# EAGLE schematic trackduino micro (EAGLE 7.1.0)
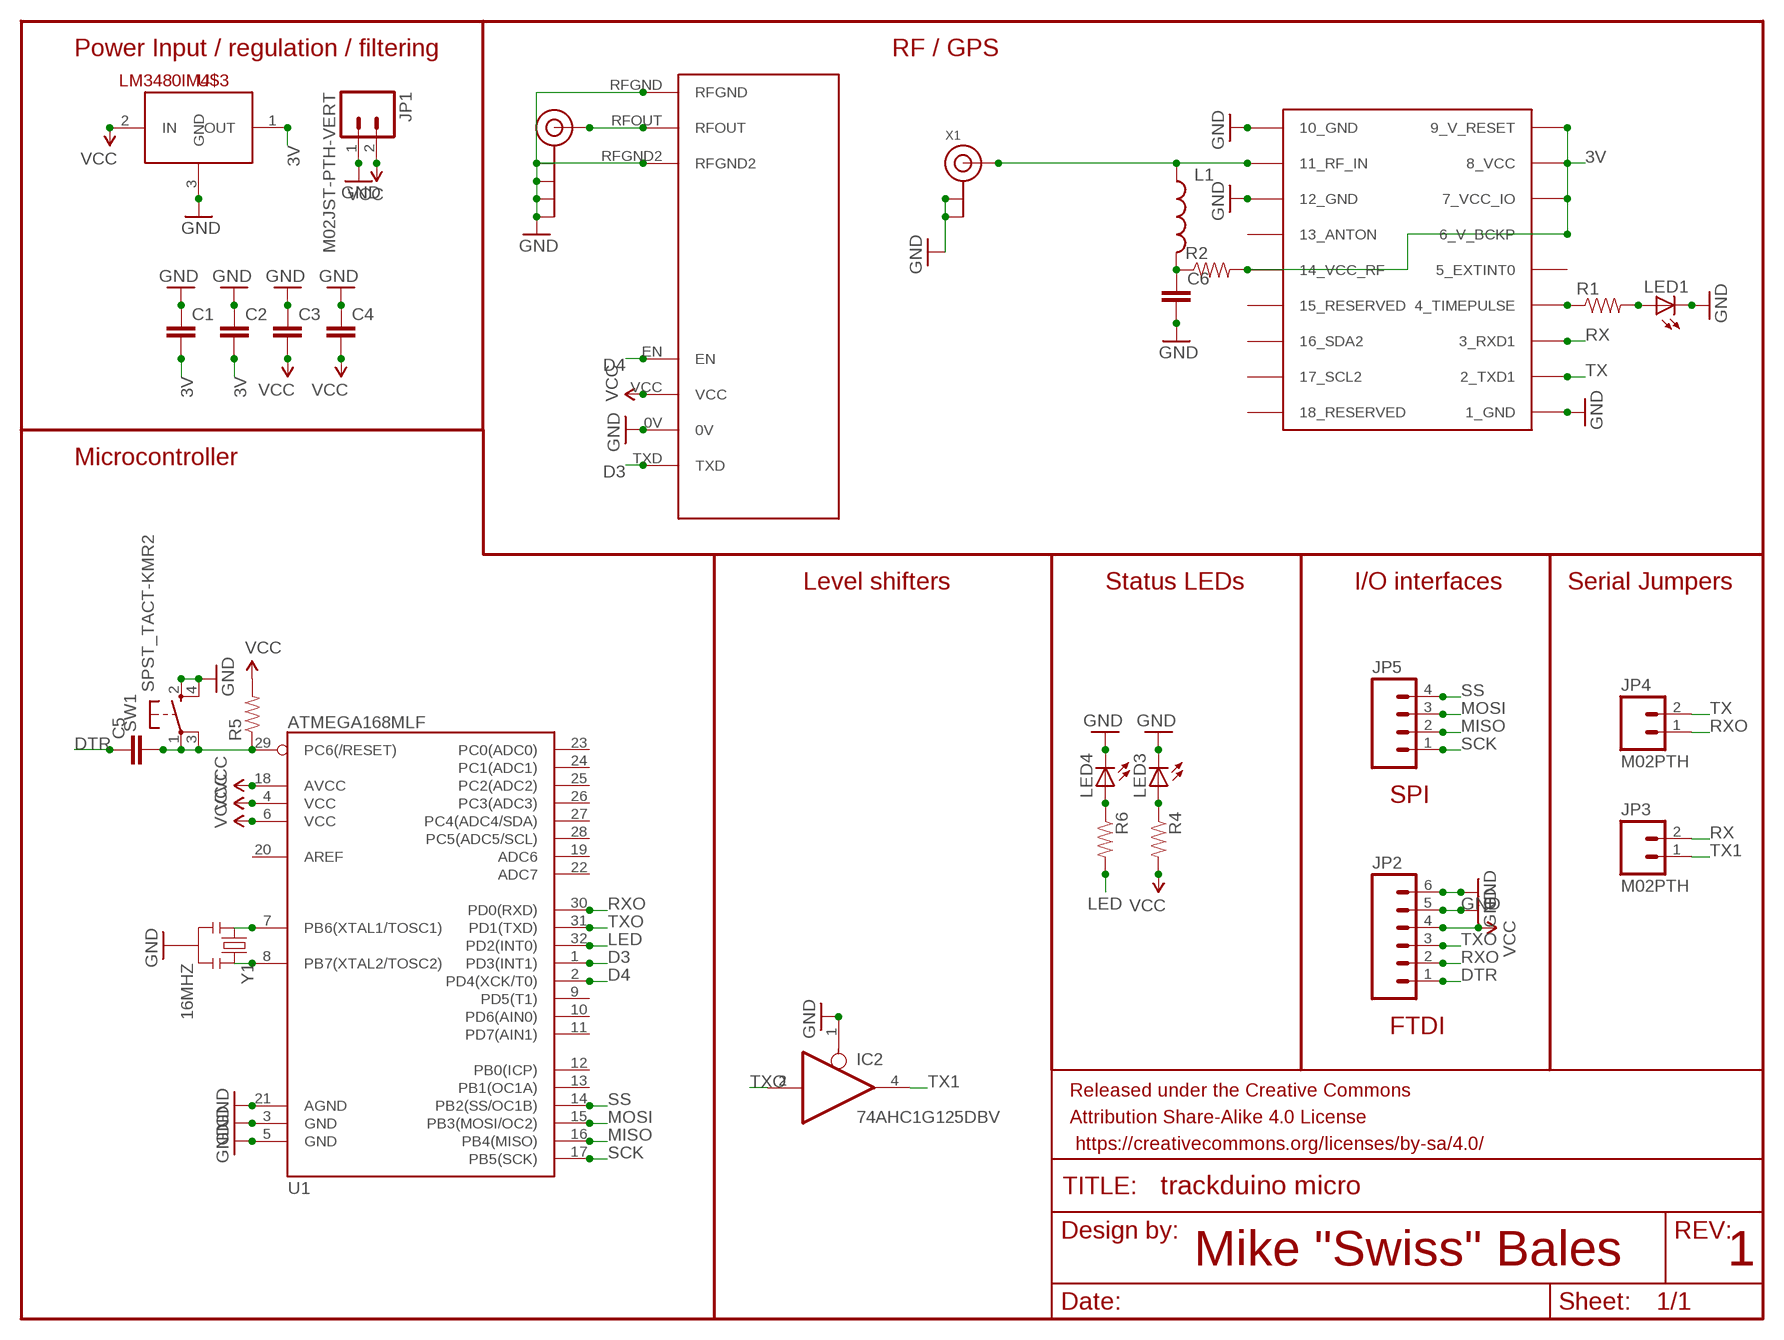
[diagram p0: schematic, sheet 1]

## Parts
C1  CAP0805  [0805]
C2  CAP0805  [0805]
C3  CAP0805  [0805]
C4  CAP0805  [0805]
C5  CAP0805  [0805]
C6  CAP0805  [0805]
FRAME1  FRAME-LETTER  [CREATIVE_COMMONS]
IC2  74AHC1G125DBV  [SOT23-5]
J$1  SMA_EDGE  [SMA-EDGE]
JP1  M02JST-PTH-VERT  [JST-2-PTH-VERT]
JP2  M06NO_SILK_FEMALE_PTH  [1X06_NO_SILK]
JP3  M02PTH  [1X02]
JP4  M02PTH  [1X02]
JP5  M041X04_NO_SILK  [1X04_NO_SILK]
L1  INDUCTOR0805  [0805]
LED1  LEDCHIP-LED0805  [CHIP-LED0805]
LED3  LEDCHIP-LED0805  [CHIP-LED0805]
LED4  LEDCHIP-LED0805  [CHIP-LED0805]
R1  RESISTOR0805-RES  [0805]
R2  RESISTOR0805-RES  [0805]
R4  RESISTOR0805-RES  [0805]
R5  RESISTOR0805-RES  [0805]
R6  RESISTOR0805-RES  [0805]
SW1  SPST_TACT-KMR2  [KMR2]
U1  ATMEGA168MLF  [MLF32]
U$1  UBLOX_MAX  [UBLOX_MAX]
U$2  RADIOMETRIX-HX1  [RADIOMETRIX-HX1]
U$3  LM3480IM4  [SOT23-3]
X1  ANTENNA_U.FL  [U.FL]
Y1  16MHZ  RESONATOR16MHZ  [RESONATOR-SMD]

## Nets
3V: C1.2 C2.2 R2.2 U$1.6_V_BCKP U$1.7_VCC_IO U$1.8_VCC U$1.9_V_RESET U$1.14_VCC_RF U$3.1(OUT)
D3: U1.1(PD3(INT1)) U$2.TXD
D4: U1.2(PD4(XCK/T0)) U$2.EN
DTR: C5.1 JP2.1
GND: C1.1 C2.1 C3.1 C4.1 C6.2 IC2.1(OE) J$1.GND@0(GND) J$1.GND@1(GND) J$1.GND@2(GND) J$1.GND@3(GND) JP1.1 JP2.5 JP2.6 LED1.C LED3.C LED4.C SW1.2(S) SW1.4(S1) U1.3(GND) U1.5(GND) U1.21(AGND) U$1.1_GND U$1.10_GND U$1.12_GND U$2.0V U$2.RFGND U$2.RFGND2 U$3.3(GND) X1.1(GND) X1.2(GND) Y1.2
LED: R6.2 U1.32(PD2(INT0))
MISO: JP5.2 U1.16(PB4(MISO))
MOSI: JP5.3 U1.15(PB3(MOSI/OC2))
N$1: J$1.SIG(SIGNAL) U$2.RFOUT
N$2: R1.1 U$1.4_TIMEPULSE
N$3: LED1.A R1.2
N$6: L1.1 U$1.11_RF_IN X1.3(SIGNAL)
N$8: LED3.A R4.1
N$9: C5.2 R5.1 SW1.1(P) SW1.3(P1) U1.29(PC6(/RESET))
N$14: U1.8(PB7(XTAL2/TOSC2)) Y1.3
N$24: C6.1 L1.2 R2.1
N$26: U1.7(PB6(XTAL1/TOSC1)) Y1.1
N$27: LED4.A R6.1
RX: JP3.2 U$1.3_RXD1
RXO: JP2.2 JP4.1 U1.30(PD0(RXD))
SCK: JP5.1 U1.17(PB5(SCK))
SS: JP5.4 U1.14(PB2(SS/OC1B))
TX: JP4.2 U$1.2_TXD1
TX1: IC2.4(O) JP3.1
TXO: IC2.2(I) JP2.3 U1.31(PD1(TXD))
VCC: C3.2 C4.2 JP1.2 JP2.4 R4.2 R5.2 U1.4(VCC) U1.6(VCC) U1.18(AVCC) U$2.VCC U$3.2(IN)
Unconnected: U1.9(PD5(T1)) U1.10(PD6(AIN0)) U1.11(PD7(AIN1)) U1.12(PB0(ICP)) U1.13(PB1(OC1A)) U1.19(ADC6) U1.20(AREF) U1.22(ADC7) U1.23(PC0(ADC0)) U1.24(PC1(ADC1)) U1.25(PC2(ADC2)) U1.26(PC3(ADC3)) U1.27(PC4(ADC4/SDA)) U1.28(PC5(ADC5/SCL)) U$1.5_EXTINT0 U$1.13_ANTON U$1.15_RESERVED U$1.16_SDA2 U$1.17_SCL2 U$1.18_RESERVED

## Notes on the sheet
- Power Input / regulation / filtering | RF / GPS
- Microcontroller
- Level shifters | Status LEDs | I/O interfaces | Serial Jumpers
- SPI
- FTDI
- Mike "Swiss" Bales | 1

## Power pins joined to a net without a drawn wire
GND: IC2.3(GND)
VCC: IC2.5(VCC)

## Library data of the parts
C1-C6 = SparkFun-Capacitors:CAP: Capacitor Standard 0603 ceramic capacitor, and 0.1" leaded capacitor.
FRAME1 = SparkFun-Aesthetics:FRAME-LETTER: Schematic Frame Standard 8.5x11 US Letter frame
IC2 = 74xx-little-us:74*1G125: Single Bus Buffer Gate with 3-State Output
J$1 = SparkFun-Connectors:SMA_EDGE: SMA Antenna Connector End launch SMA connector. The paste layer has been removed so that the connector can be hand soldered onto the board after reflow.
JP1 JP3 JP4 = SparkFun-Connectors:M02: Standard 2-pin 0.1" header. Use with - straight break away headers ( PRT-00116) - right angle break away headers (PRT-00553) - swiss pins (PRT-00743) - machine pins (PRT-00117) - female headers (PRT-00115) Molex polarized connector foot print use with: PRT-08233 with associated crimp pins and housings. 2.54_SCREWTERM for use with PRT-10571. 3.5mm Screw Terminal footprints for PRT-08084 5mm Screw Terminal footprints for use with PRT-08432
JP2 = SparkFun-Connectors:M06: Header 6 Standard 6-pin 0.1" header. Use with straight break away headers (SKU : PRT-00116), right angle break away headers (PRT-00553), swiss pins (PRT-00743), machine pins (PRT-00117), and female headers (PRT-00115). Molex polarized connector foot print use with SKU : PRT-08094 with associated crimp pins and housings. NOTES ON THE VARIANTS LOCK and LOCK_LONGPADS... This footprint was designed to help hold the alignment of a through-hole component (i.e. 6-pin header) while soldering it into place. You may notice that each hole has been shifted either up or down by 0.005 of an inch from it's more standard position (which is a perfectly straight line). This slight alteration caused the pins (the squares in the middle) to touch the edges of the holes. Because they are alternating, it causes a "brace" to hold the component in place. 0.005 has proven to be the perfect amount of "off-center" position when using our standard breakaway headers. Although looks a little odd when you look at the bare footprint, once you have a header in there, the alteration is very hard to notice. Also,if you push a header all the way into place, it is covered up entirely on the bottom side. This idea of altering the position of holes to aid alignment will be further integrated into the Sparkfun Library for other footprints. It can help hold any component with 3 or more connection pins.; PROD_ID: CONN-08437
JP5 = SparkFun-Connectors:M04: Header 4 Standard 4-pin 0.1" header. Use with straight break away headers (SKU : PRT-00116), right angle break away headers (PRT-00553), swiss pins (PRT-00743), machine pins (PRT-00117), and female headers (PRT-00115). Molex polarized connector foot print use with SKU : PRT-08231 with associated crimp pins and housings. 1MM SMD Version SKU: PRT-10208
L1 = SparkFun-Passives:INDUCTOR: Inductors Basic Inductor/Choke - 0603 and 1206. Footprints are not proven and vary greatly between part numbers. SRN6045- 33uH, 20% 1.4A SDR0403-560KL - 56uH, 10%, 500mA RMS/740mA peak
LED1 LED3 LED4 = adafruit:LED: LED OSRAM: - CHIPLED LG R971, LG N971, LY N971, LG Q971, LY Q971, LO R971, LY R971 LH N974, LH R974 LS Q976, LO Q976, LY Q976 LO Q996 - Hyper CHIPLED LW Q18S LB Q993, LB Q99A, LB R99A - SideLED LS A670, LO A670, LY A670, LG A670, LP A670 LB A673, LV A673, LT A673, LW A673 LH A674 LY A675 LS A676, LA A676, LO A676, LY A676, LW A676 LS A679, LY A679, LG A679 - Hyper Micro SIDELED® LS Y876, LA Y876, LO Y876, LY Y876 LT Y87S - SmartLED LW L88C, LW L88S LB L89C, LB L89S, LG L890 LS L89K, LO L89K, LY L89K LS L896, LA L896, LO L896, LY L896 - TOPLED LS T670, LO T670, LY T670, LG T670, LP T670 LSG T670, LSP T670, LSY T670, LOP T670, LYG T670 LG T671, LOG T671, LSG T671 LB T673, LV T673, LT T673, LW T673 LH T674 LS T676, LA T676, LO T676, LY T676, LB T676, LH T676, LSB T676, LW T676 LB T67C, LV T67C, LT T67C, LS T67K, LO T67K, LY T67K, LW E67C LS E67B, LA E67B, LO E67B, LY E67B, LB E67C, LV E67C, LT E67C LW T67C LS T679, LY T679, LG T679 LS T770, LO T770, LY T770, LG T770, LP T770 LB T773, LV T773, LT T773, LW T773 LH T774 LS E675, LA E675, LY E675, LS T675 LS T776, LA T776, LO T776, LY T776, LB T776 LHGB T686 LT T68C, LB T68C - Hyper Mini TOPLED® LB M676 - Mini TOPLED Santana® LG M470 LS M47K, LO M47K, LY M47K Source: http://www.osram.convergy.de/
R1 R2 R4-R6 = SparkFun-Resistors:RESISTOR: Resistor Basic schematic elements and footprints for 0603, 1206, and PTH resistors.
SW1 = adafruit:SPST_TACT: SMT 6mm switch, EVQQ2 series http://www.ladyada.net/library/eagle
U1 = SparkFun-DigitalIC:ATMEGA168: Atmel 32-pin 8-bit micro, 16k flash.
U$1 = Ava:UBLOX_MAX: UBLOX MAX
U$2 = Ava:RADIOMETRIX-HX1
U$3 = SparkFun-PowerIC:LM3480IM4: Small package linear regulator
X1 = adafruit:ANTENNA_U.FL: U.FL Antenna Connector
Y1 = SparkFun-FreqCtrl:RESONATOR: Resonator Small SMD resonator. Used, eg, on the Arduino Pro/ Pro Mini boards. 8MHz- XTAL-08895 16MHz- XTAL-08900; PROD_ID: XTAL-08900